# EAGLE schematic 450B679C (EAGLE 6.1)
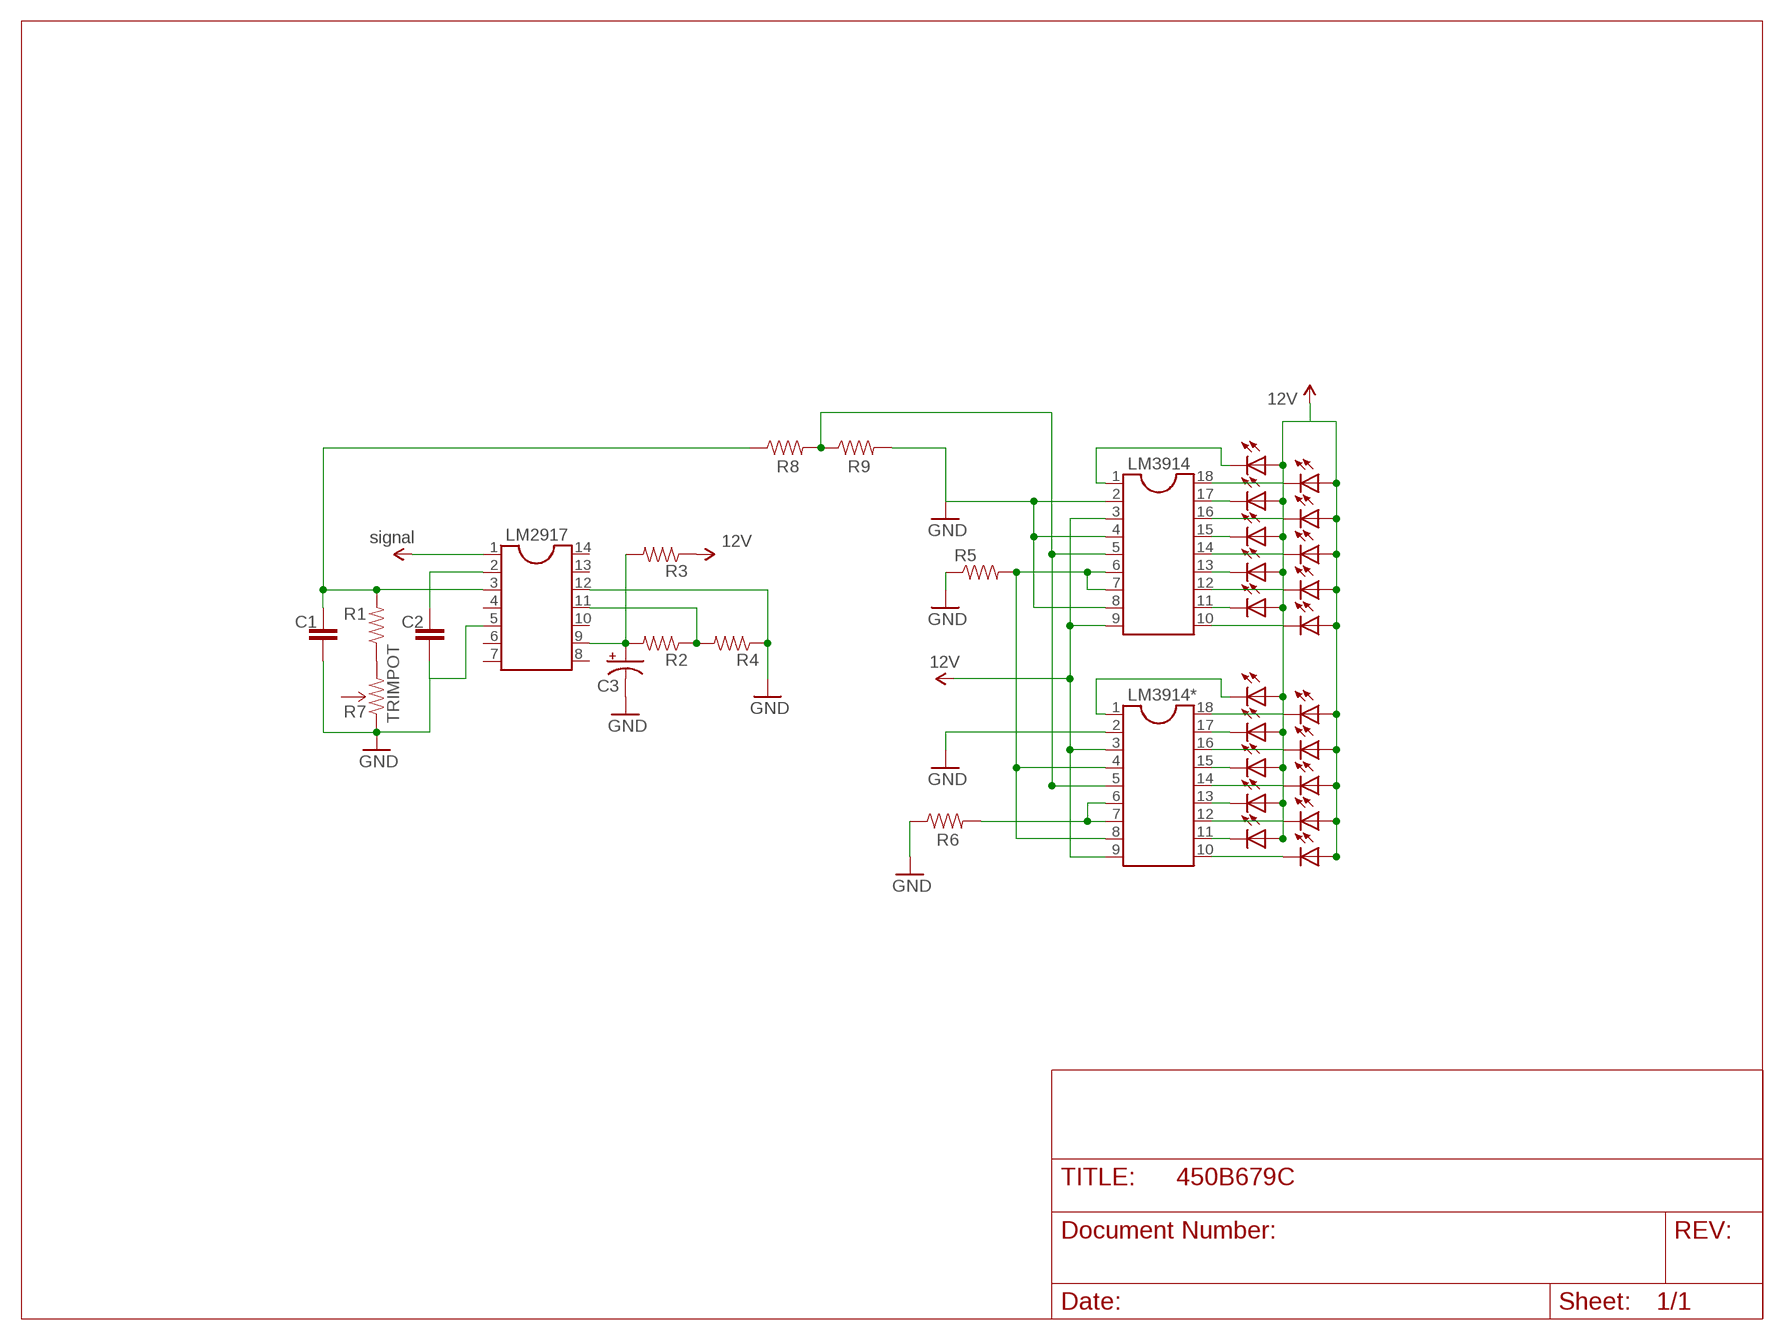
[diagram p0: schematic, sheet 1]

## Parts
C1  CAPPTH1  [CAP-PTH-5MM]
C2  CAPPTH1  [CAP-PTH-5MM]
C3  CAP_POLPTH2  [CPOL-RADIAL-10UF-25V]
LED1  LED5MM  [LED5MM]
LED2  LED5MM  [LED5MM]
LED3  LED5MM  [LED5MM]
LED4  LED5MM  [LED5MM]
LED5  LED5MM  [LED5MM]
LED6  LED5MM  [LED5MM]
LED7  LED5MM  [LED5MM]
LED8  LED5MM  [LED5MM]
LED9  LED5MM  [LED5MM]
LED10  LED5MM  [LED5MM]
LED11  LED5MM  [LED5MM]
LED12  LED5MM  [LED5MM]
LED13  LED5MM  [LED5MM]
LED14  LED5MM  [LED5MM]
LED15  LED5MM  [LED5MM]
LED16  LED5MM  [LED5MM]
LED17  LED5MM  [LED5MM]
LED18  LED5MM  [LED5MM]
LED19  LED5MM  [LED5MM]
LED20  LED5MM  [LED5MM]
LM2917  DIL14  [DIL14]
LM3914  DIL18  [DIL18]
LM3914*  DIL18  [DIL18]
R1  RESISTORPTH-1/4W  [AXIAL-0.4]
R2  RESISTORPTH-1/4W  [AXIAL-0.4]
R3  RESISTORPTH-1/4W  [AXIAL-0.4]
R4  RESISTORPTH-1/4W  [AXIAL-0.4]
R5  RESISTORPTH-1/4W  [AXIAL-0.4]
R6  RESISTORPTH-1/4W  [AXIAL-0.4]
R7  TRIMPOT  [3362U-2]
R8  RESISTORPTH-1/4W  [AXIAL-0.4]
R9  RESISTORPTH-1/4W  [AXIAL-0.4]

## Nets
5V: LED1.A LED2.A LED3.A LED4.A LED5.A LED6.A LED7.A LED8.A LED9.A LED10.A LED11.A LED12.A LED13.A LED14.A LED15.A LED16.A LED17.A LED18.A LED19.A LED20.A LM2917.1 LM3914*.3 LM3914*.9 LM3914.3 LM3914.9 R3.P$1 ; supply symbol labelled 12V, signal
GND: C1.1 C2.1 C3.2(-) LM2917.5 LM2917.12 LM3914*.2 LM3914.2 LM3914.4 LM3914.8 R4.P$1 R5.P$1 R6.P$1 R7.1(CCW) R9.P$2
N$1: C3.1(+) LM2917.9 R2.P$2 R3.P$2
N$2: C2.2 LM2917.2
N$3: LM2917.11 R2.P$1 R4.P$2
N$4: LM3914*.6 LM3914*.7 R6.P$2
N$5: LED1.K(C) LM3914.1
N$6: LM3914*.4 LM3914*.8 LM3914.6 LM3914.7 R5.P$2
N$8: LED2.K(C) LM3914.18
N$9: LED4.K(C) LM3914.17
N$10: LED3.K(C) LM3914.16
N$11: LED5.K(C) LM3914.15
N$12: LED6.K(C) LM3914.14
N$13: LED7.K(C) LM3914.13
N$14: LED8.K(C) LM3914.12
N$15: LED10.K(C) LM3914.11
N$16: LED9.K(C) LM3914.10
N$17: LED11.K(C) LM3914*.1
N$18: LED12.K(C) LM3914*.18
N$19: LED18.K(C) LM3914*.17
N$20: LED17.K(C) LM3914*.16
N$21: LED13.K(C) LM3914*.15
N$22: LED20.K(C) LM3914*.14
N$23: LED14.K(C) LM3914*.13
N$24: LED15.K(C) LM3914*.12
N$25: LED19.K(C) LM3914*.11
N$26: LED16.K(C) LM3914*.10
N$27: LM3914*.5 LM3914.5 R8.P$2 R9.P$1
N$28: C1.2 LM2917.3 R1.P$2 R8.P$1
N$29: R1.P$1 R7.3(CW)
Unconnected: LM2917.4 LM2917.6 LM2917.7 LM2917.8 LM2917.10 LM2917.13 LM2917.14 R7.2(WIPER)

## Library data of the parts
C1 C2 = SparkFun:CAP: Capacitor Standard 0603 ceramic capacitor, and 0.1" leaded capacitor.
C3 = SparkFun:CAP_POL: Capacitor Polarized These are standard SMD and PTH capacitors. Normally 10uF, 47uF, and 100uF in electrolytic and tantalum varieties. Always verify the external diameter of the through hole cap, it varies with capacity, voltage, and manufacturer. The EIA devices should be standard.
LED1-LED20 = adafruit:LED: LED OSRAM: - CHIPLED LG R971, LG N971, LY N971, LG Q971, LY Q971, LO R971, LY R971 LH N974, LH R974 LS Q976, LO Q976, LY Q976 LO Q996 - Hyper CHIPLED LW Q18S LB Q993, LB Q99A, LB R99A - SideLED LS A670, LO A670, LY A670, LG A670, LP A670 LB A673, LV A673, LT A673, LW A673 LH A674 LY A675 LS A676, LA A676, LO A676, LY A676, LW A676 LS A679, LY A679, LG A679 - Hyper Micro SIDELED® LS Y876, LA Y876, LO Y876, LY Y876 LT Y87S - SmartLED LW L88C, LW L88S LB L89C, LB L89S, LG L890 LS L89K, LO L89K, LY L89K LS L896, LA L896, LO L896, LY L896 - TOPLED LS T670, LO T670, LY T670, LG T670, LP T670 LSG T670, LSP T670, LSY T670, LOP T670, LYG T670 LG T671, LOG T671, LSG T671 LB T673, LV T673, LT T673, LW T673 LH T674 LS T676, LA T676, LO T676, LY T676, LB T676, LH T676, LSB T676, LW T676 LB T67C, LV T67C, LT T67C, LS T67K, LO T67K, LY T67K, LW E67C LS E67B, LA E67B, LO E67B, LY E67B, LB E67C, LV E67C, LT E67C LW T67C LS T679, LY T679, LG T679 LS T770, LO T770, LY T770, LG T770, LP T770 LB T773, LV T773, LT T773, LW T773 LH T774 LS E675, LA E675, LY E675, LS T675 LS T776, LA T776, LO T776, LY T776, LB T776 LHGB T686 LT T68C, LB T68C - Hyper Mini TOPLED® LB M676 - Mini TOPLED Santana® LG M470 LS M47K, LO M47K, LY M47K Source: http://www.osram.convergy.de/
LM2917 = ic-package:DIL14: Dual In Line / Socket
LM3914 LM3914* = ic-package:DIL18: Dual In Line / Socket
R1-R6 R8 R9 = SparkFun:RESISTOR: Resistor Basic schematic elements and footprints for 0603, 1206, and PTH resistors.
R7 = SparkFun:TRIMPOT